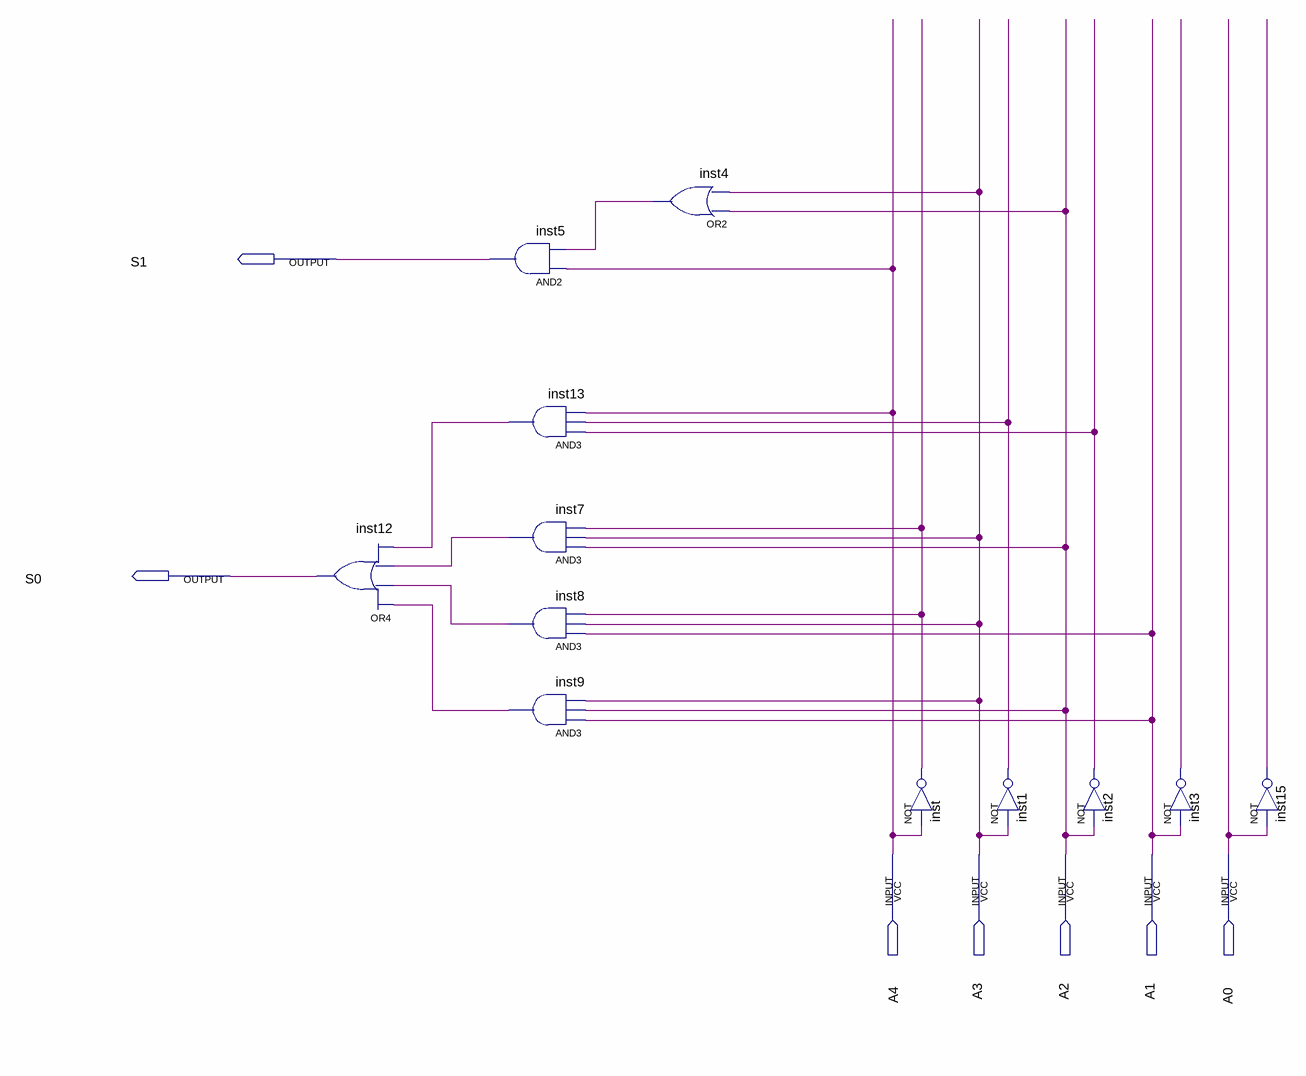
[diagram p0: schematic sheet]
// Quartus schematic dezenas.bdf as structural Verilog: 12 symbols, 7 pins
module dezenas (
  input  A4,
  input  A3,
  input  A2,
  input  A1,
  input  A0,
  output S1,
  output S0
);

  wire inst1_out, inst2_out, inst3_out, inst4_out, inst7_out, inst8_out, inst9_out, inst13_out, inst15_out,
       inst_out;

  or inst12 (S0, inst9_out, inst8_out, inst7_out, inst13_out);
  and inst5 (S1, A4, inst4_out);
  and inst13 (inst13_out, inst2_out, inst1_out, A4);
  and inst7 (inst7_out, A2, A3, inst_out);
  and inst8 (inst8_out, A1, A3, inst_out);
  and inst9 (inst9_out, A1, A2, A3);
  or inst4 (inst4_out, A2, A3);
  not inst (inst_out, A4);
  not inst1 (inst1_out, A3);
  not inst2 (inst2_out, A2);
  not inst3 (inst3_out, A1);
  not inst15 (inst15_out, A0);
endmodule
